# EAGLE schematic squareinator2 (EAGLE 6.5.0)
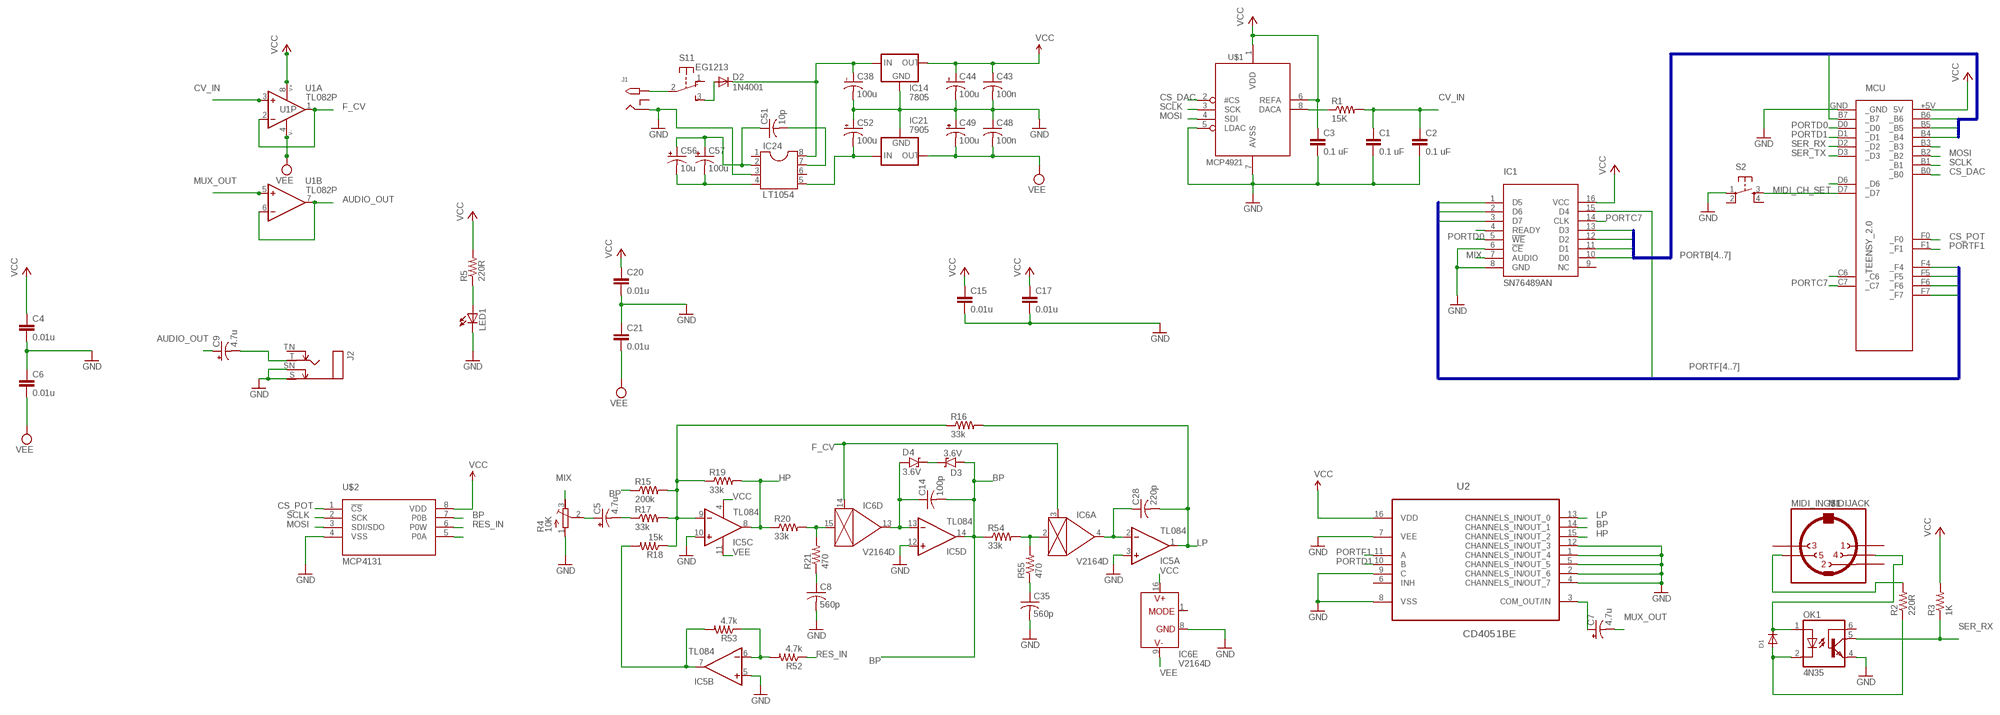
[diagram p0: schematic, sheet 1]

## Parts
C1  0.1 uF  CAPEZ  [CAP-PTH-SMALLEZ]
C2  0.1 uF  CAPEZ  [CAP-PTH-SMALLEZ]
C3  0.1 uF  CAPEZ  [CAP-PTH-SMALLEZ]
C4  0.01u  CAPEZ  [CAP-PTH-SMALLEZ]
C5  4.7u  CPOL-USE2.5-6  [E2,5-6]
C6  0.01u  CAPEZ  [CAP-PTH-SMALLEZ]
C7  4.7u  CPOL-USE2.5-6  [E2,5-6]
C8  560p  C-US025-025X050  [C025-025X050]
C9  4.7u  CPOL-USE2.5-6  [E2,5-6]
C14  100p  C-US025-025X050  [C025-025X050]
C15  0.01u  CAPEZ  [CAP-PTH-SMALLEZ]
C17  0.01u  CAPEZ  [CAP-PTH-SMALLEZ]
C20  0.01u  CAPEZ  [CAP-PTH-SMALLEZ]
C21  0.01u  CAPEZ  [CAP-PTH-SMALLEZ]
C28  220p  C-US025-025X050  [C025-025X050]
C35  560p  C-US025-025X050  [C025-025X050]
C38  100u  CPOL-USE2.5-7  [E2,5-7]
C43  100n  C-US025-025X050  [C025-025X050]
C44  100u  CPOL-USE2.5-7  [E2,5-7]
C48  100n  C-US025-025X050  [C025-025X050]
C49  100u  CPOL-USE2.5-7  [E2,5-7]
C51  10p  C-US025-025X050  [C025-025X050]
C52  100u  CPOL-USE2.5-7  [E2,5-7]
C56  10u  CPOL-USE2.5-5  [E2,5-5]
C57  100u  CPOL-USE2.5-6  [E2,5-6]
D1  DIODEDO-1N4148  [DO-1N4148]
D2  1N4001  1N4004  [DO41-10]
D3  3.6V  1N47XXDO35  [D-5]
D4  3.6V  1N47XXDO35  [D-5]
IC1  SN76489AN  [DIL16]
IC5  TL084  TL084P  [DIL14]
IC6  V2164D  SSM2164P  [DIL16]
IC14  7805  78XXS  [78XXS]
IC21  7905  79XXS  [79XXS]
IC24  LT1054  DIL8  [DIL08]
J1  2.1MMJACKTHM  [PJ-102A]
J2  MONOSWS  [NMJ4HC-S]
LED1  LED3MM  [LED3MM]
MCU  TEENSY_2.0  TEENSYTEENSY_LESSPINS  [TEENSY]
MIDI_IN  MIDIJACK  [CP-2350]
OK1  4N35  [DIL06]
R1  15K  RESISTOREZ  [AXIAL-0.3EZ]
R2  220R  RESISTOREZ  [AXIAL-0.3EZ]
R3  1K  RESISTOREZ  [AXIAL-0.3EZ]
R4  10K  R-TRIMM3296P  [RTRIM3296P]
R5  220R  RESISTOREZ  [AXIAL-0.3EZ]
R15  200k  R-US_0204/7  [0204/7]
R16  33k  R-US_0204/7  [0204/7]
R17  33k  R-US_0204/7  [0204/7]
R18  15k  R-US_0204/7  [0204/7]
R19  33k  R-US_0204/7  [0204/7]
R20  33k  R-US_0204/7  [0204/7]
R21  470  R-US_0204/7  [0204/7]
R52  4.7k  R-US_0204/7  [0204/7]
R53  4.7k  R-US_0204/7  [0204/7]
R54  33k  R-US_0204/7  [0204/7]
R55  470  R-US_0204/7  [0204/7]
S1  EG1213  [EG1213]
S2  TAC_SWITCHPTH  [TACTILE-PTH]
U1  TL082P  [DIL08]
U2  CD4051BE  [DIP254P762X508-16]
U$1  MCP4921  [DIL08]
U$2  MCP4131  [DIL8]

## Nets
AUDIO_JACK: C9.- J2.T
AUDIO_OUT: C9.+ U1.6(B:-IN) U1.7(B:OUT)
BP: C14.2 D3.A IC5.14(D:OUT) R15.1 R54.1 U2.14(CHANNELS_IN/OUT_1) U$2.7(P0B)
CS_DAC: MCU.B0(_B0) U$1.2(#CS)
CS_POT: MCU.F0(_F0) U$2.1(!CS)
CV_IN: C1.1 C2.1 R1.P$2 U1.3(A:+IN)
F_CV: IC6.3(A:CTRL) IC6.14(D:CTRL) U1.1(A:OUT) U1.2(A:-IN)
GND: C1.2 C2.2 C3.2 C4.2 C6.1 C8.2 C15.2 C17.2 C20.2 C21.1 C35.2 C38.- C43.2 C44.- C48.1 C49.+ C52.+ IC1.6(!CE) IC1.8(GND) IC5.3(A:+IN) IC5.5(B:+IN) IC5.10(C:+IN) IC5.12(D:+IN) IC6.8(E:GND) IC14.GND IC21.GND IC24.3 J1.RING J2.S J2.SN LED1.K(C) MCU.GND(_GND) OK1.4(EMI) R4.1(A) S2.1 U2.1(CHANNELS_IN/OUT_4) U2.2(CHANNELS_IN/OUT_6) U2.4(CHANNELS_IN/OUT_7) U2.5(CHANNELS_IN/OUT_5) U2.7(VEE) U2.8(VSS) U2.9(C) U2.12(CHANNELS_IN/OUT_3) U$1.5(LDAC) U$1.7(AVSS) U$2.4(VSS)
HP: IC5.8(C:OUT) R19.2 R20.1 U2.15(CHANNELS_IN/OUT_2)
LP: C28.2 IC5.1(A:OUT) R16.2 U2.13(CHANNELS_IN/OUT_0)
MIDI_CH_SET: MCU.D7(_D7) S2.3
MIX: IC1.7(AUDIO) R4.3(E)
MOSI: MCU.B2(_B2) U$1.4(SDI) U$2.3(SDI/SDO)
MUX_OUT: C7.- U1.5(B:+IN)
N$1: R1.P$1 U$1.8(DACA)
N$2: LED1.A R5.P$1
N$3: D1.A OK1.2(C) R2.P$1
N$4: IC1.4(READY)
N$6: J1.TIP S1.2(1:P)
N$7: D2.A S1.3(1:S)
N$8: C51.1 C56.+ C57.+ IC24.2
N$9: IC5.9(C:-IN) R15.2 R16.1 R17.2 R18.1 R19.1
N$10: C28.1 IC5.2(A:-IN) IC6.4(A:OUT)
N$11: C8.1 R21.1
N$12: D1.C MIDI_IN.4 OK1.1(A)
N$13: IC5.6(B:-IN) R52.2 R53.1
N$14: IC5.7(B:OUT) R18.2 R53.2
N$15: C5.- R17.1
N$16: C7.+ U2.3(COM_OUT/IN)
N$17: C35.1 R55.1
N$19: C14.1 D4.A IC5.13(D:-IN) IC6.13(D:OUT)
N$20: U$2.5(P0A)
N$21: C38.+ D2.C IC14.IN IC24.8
N$22: C52.- IC21.IN IC24.5
N$26: IC6.2(A:IN) R54.2 R55.2
N$29: IC6.15(D:IN) R20.2 R21.2
N$31: MIDI_IN.5 R2.P$2
N$32: C5.+ R4.2(S)
N$34: MCU.D6(_D6)
N$48: C56.- C57.- IC24.4
N$49: C51.2 IC24.7
N$54: MCU.C6(_C6)
N$55: D3.C D4.C
PORTB3: MCU.B3(_B3)
PORTB4: IC1.10(D0) MCU.B4(_B4)
PORTB5: IC1.11(D1) MCU.B5(_B5)
PORTB6: IC1.12(D2) MCU.B6(_B6)
PORTB7: IC1.13(D3) MCU.B7(_B7)
PORTC7: IC1.14(CLK) MCU.C7(_C7)
PORTD0: IC1.5(!WE) MCU.D0(_D0)
PORTD1: MCU.D1(_D1) U2.10(B)
PORTF1: MCU.F1(_F1) U2.11(A)
PORTF4: IC1.15(D4) MCU.F4(_F4)
PORTF5: IC1.1(D5) MCU.F5(_F5)
PORTF6: IC1.2(D6) MCU.F6(_F6)
PORTF7: IC1.3(D7) MCU.F7(_F7)
RES_IN: R52.1 U$2.6(P0W)
SCLK: MCU.B1(_B1) U$1.3(SCK) U$2.2(SCK)
SER_RX: MCU.D2(_D2) OK1.5(COL) R3.P$1
SER_TX: MCU.D3(_D3)
VCC: C3.1 C4.1 C15.1 C17.1 C20.1 C43.1 C44.+ IC1.16(VCC) IC5.4(P:V+) IC6.16(E:V+) IC14.OUT MCU.+5V(5V) R3.P$2 R5.P$2 U1.8(P:V+) U2.16(VDD) U$1.1(VDD) U$1.6(REFA) U$2.8(VDD)
VEE: C6.2 C21.2 C48.2 C49.- IC5.11(P:V-) IC6.9(E:V-) IC21.OUT U1.4(P:V-)
Unconnected: IC1.9(NC) IC6.1(E:MODE) IC6.5(B:OUT) IC6.6(B:CTRL) IC6.7(B:IN) IC6.10(C:IN) IC6.11(C:CTRL) IC6.12(C:OUT) IC24.1 IC24.6 J1.RING_SW J2.TN MIDI_IN.1 MIDI_IN.2 MIDI_IN.3 MIDI_IN.PE1(MT) MIDI_IN.PE2(MT) MIDI_IN.PE(MT) MIDI_IN.PE@(MT) OK1.6(BAS) S1.1(1:O) S1.MT1(MT) S1.MT2(MT) S2.2 S2.4 U2.6(INH)

## Buses
PORTB[4..7]
PORTF[4..7]

## Library data of the parts
C1-C3 = SparkFun-Capacitors:CAP: Capacitor Standard 0603 ceramic capacitor, and 0.1" leaded capacitor.
C4 C6 C15 C17 C20 C21 = SparkFun-Passives:CAP: Capacitor Standard 0603 ceramic capacitor, and 0.1" leaded capacitor.
C5 C7 C9 C38 C44 C49 C52 C56 C57 = rcl:CPOL-US: POLARIZED CAPACITOR, American symbol
C8 C14 C28 C35 C43 C48 C51 = rcl:C-US: CAPACITOR, American symbol
D1 = adafruit:DIODE: Diode SMADIODE - SMA Surface Mount Package 20V 1A Schottky Diode Digikey: 641-1014-6-ND DO-1N4148 - Through Hole Small Current Diode SOD-123 20V 1 A (.5mV Vf) Schottky Diode - Digikey: MBRX120TPMSCT-ND SOD-323 10V 570mA (.38mV Vf, 3ns) Schottky Diode - Digikey: ZLLS410CT-ND SOD-523 30V 30mA Schottky Diode (RB751S-40TE61) - Digikey: RB751S-40TE61CT-ND SOT23-R/W - SOT23 Package (R = Solder Paste/Reflow Ovens, W = Hand-Soldering) BAT54Film 40V 300mA - Digikey: 497-7162-1-ND
D2 = diode:1N4004: DIODE general purpose rectifier, 1 A
D3 D4 = og-diodes:1N47XX: Zener Diode 1N4728 - 1N4764: 3.3 V - 100V, 10% (1n47xxA 5%); DO-41 glass case
IC1 = alex-parts:SN76489AN: TI SN76489AN Sound Generator
IC5 = linear:TL084: OP AMP
IC6 = ssm2164:SSM2164
IC14 = v-reg:78XXS: VOLTAGE REGULATOR
IC21 = v-reg:79XXS: VOLTAGE REGULATOR
IC24 = ic-package:DIL8: Dual In Line / Socket
J1 = adafruit:2.1MMJACK: 2.1mm x 5.5mm THM DC jack with internal switch. Digikey part #PJ-102A, 4UCON part #05537 2.1mm x 5.5mm SMT DC jack with internal switch. Digikey part #PJ-002A-SMT, 4UCON part #03267 By microbuilder.eu & adafruit.com
J2 = gm-jacks:MONOSW
LED1 = adafruit:LED: LED OSRAM: - CHIPLED LG R971, LG N971, LY N971, LG Q971, LY Q971, LO R971, LY R971 LH N974, LH R974 LS Q976, LO Q976, LY Q976 LO Q996 - Hyper CHIPLED LW Q18S LB Q993, LB Q99A, LB R99A - SideLED LS A670, LO A670, LY A670, LG A670, LP A670 LB A673, LV A673, LT A673, LW A673 LH A674 LY A675 LS A676, LA A676, LO A676, LY A676, LW A676 LS A679, LY A679, LG A679 - Hyper Micro SIDELED® LS Y876, LA Y876, LO Y876, LY Y876 LT Y87S - SmartLED LW L88C, LW L88S LB L89C, LB L89S, LG L890 LS L89K, LO L89K, LY L89K LS L896, LA L896, LO L896, LY L896 - TOPLED LS T670, LO T670, LY T670, LG T670, LP T670 LSG T670, LSP T670, LSY T670, LOP T670, LYG T670 LG T671, LOG T671, LSG T671 LB T673, LV T673, LT T673, LW T673 LH T674 LS T676, LA T676, LO T676, LY T676, LB T676, LH T676, LSB T676, LW T676 LB T67C, LV T67C, LT T67C, LS T67K, LO T67K, LY T67K, LW E67C LS E67B, LA E67B, LO E67B, LY E67B, LB E67C, LV E67C, LT E67C LW T67C LS T679, LY T679, LG T679 LS T770, LO T770, LY T770, LG T770, LP T770 LB T773, LV T773, LT T773, LW T773 LH T774 LS E675, LA E675, LY E675, LS T675 LS T776, LA T776, LO T776, LY T776, LB T776 LHGB T686 LT T68C, LB T68C - Hyper Mini TOPLED® LB M676 - Mini TOPLED Santana® LG M470 LS M47K, LO M47K, LY M47K Source: http://www.osram.convergy.de/
MCU = alex-parts:TEENSY: Teensy 2.0
MIDI_IN = adafruit:MIDIJACK: DIN 5 jack also known as MIDI jack A modification of conn-hirshman:MAB5SH with two options for the grounding 'teeth'
OK1 = optocoupler:4N35: MOTOROLA OPTO COUPLER; MF: FAIRCHILD SEMICONDUCTOR; MPN: 4N35; OC_FARNELL: 1328375; OC_NEWARK: 72K9946
R1-R3 R5 = SparkFun-Passives:RESISTOR: Resistor Basic schematic elements and footprints for 0603, 1206, and PTH resistors.
R4 = rcl:R-TRIMM: Trimm resistor
R15-R21 R52-R55 = rcl:R-US_: RESISTOR, American symbol
S1 = adafruit:EG1213: E-Switch right-angle slide SPDT Part #EG1213 http://www.ladyada.net/library/eagle
S2 = SparkFun-Electromechanical:TAC_SWITCH: Momentary Switch Button commonly used for reset or general input. Spark Fun Electronics SKU : COM-00097 SMT- SWCH-08247
U1 = op-amp:TL082: JFET OP-AMP - Dual
U2 = alex-parts:CD4051BE: The CD4051B is a single 8-Channel multiplexer having three binary control inputs.; MPN: CD4051BE; OC_FARNELL: 1106109; OC_NEWARK: 60K5119; PACKAGE: PDIP-16; SUPPLIER: Texas Instruments
U$1 = adafruit:MCP4921
U$2 = alex-parts:MCP4131: MCP4131 single SPI digital pot 128-step 100K

## Net classes
0 default: width 0.305 mm